# Altium schematic sheet Current Sensor.SchDoc
size A4; SheetNumber: 7; SheetTotal: 13
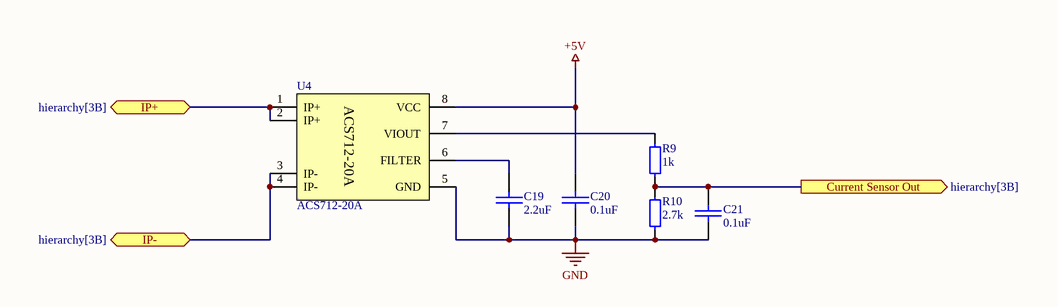
[diagram p0: Current Sensor.SchDoc]

## Parts
C19  2.2uF  [0805 Capicator]
C20  0.1uF  [0805 Capicator]
C21  0.1uF  [0805 Capicator]
R9  1k  [0805 Resistor]
R10  2.7k  [0805 Resistor]
U4  ACS712-20A  [SOIC-8]

## Ports
Current Sensor Out (out, see hierarchy[3B]), IP+ (bidir, see hierarchy[3B]), IP- (bidir, see hierarchy[3B])

## Nets
+5V: C20.2 U4.8(VCC)
GND: C19.2 C20.1 C21.1 R10.1 U4.5(GND)
Current Sensor Out: C21.2 R9.1 R10.2 ; port Current Sensor Out
IP+: U4.1(IP+) U4.2(IP+) ; port IP+
IP-: U4.3(IP-) U4.4(IP-) ; port IP-
NetC19_1: C19.1 U4.6(FILTER)
NetR9_2: R9.2 U4.7(VIOUT)

## Library data of the parts
C19 = Cap 2.2uF (0805): 2.2uF X7R 25V 0805; Manufacturer: Murata Manufacturing; Part Number: GRM21BR71E225KA73L; Type: Capacitor; ComponentLink1Description: Chip&Dip; ComponentLink1URL: https://www.chipdip.ru/product/grm21br71e225k
C20 C21 = Cap 0.1uF (0805): 0.1uF X7R 25V 10% 0805; Manufacturer: Murata Manufacturing; Part Number: GRM21BR71E104KA01L; Type: Capacitor; ComponentLink1Description: Chip&Dip; ComponentLink1URL: https://www.chipdip.ru/product/grm21br71e104ka01l
R9 = Res 1k (0805): 0.125W 0805 1k, 1%; Part Number: RC0805FR-071KL; Manufacturer: Taiwan; Type: Resistor; ComponentLink1Description: Chip&Dip; ComponentLink1URL: https://www.chipdip.ru/product0/9000079486
R10 = Resistor 2.7k (0805): 0805 0.125W 5% 5.6kOhm; Type: Resistor; ComponentLink1Description: Buy; ComponentLink1URL: https://radioremont.com/product/rezistor-0805-0-125-vt-5-2-7-kom-10-shtuk-r24-47/
U4 = Current Sensor ACS712-20A: Fully Integrated, Hall Effect-Based Linear Current Sensor / with 2.1 kVRMS Voltage Isolation and a Low-Resistance Current Conductor; Type: IC; ComponentLink1Description: Buy; ComponentLink1URL: https://market.yandex.ru/product--datchik-toka-acs712-20a/1401516335?sku=101392740192&do-waremd5=sGhOYPiH-8CIFljtPXNesw&uniqueId=848420; ComponentLink2Description: Datasheet; ComponentLink2URL: https://robot-kit.ru/wa-data/public/blog/download/ACS712.pdf